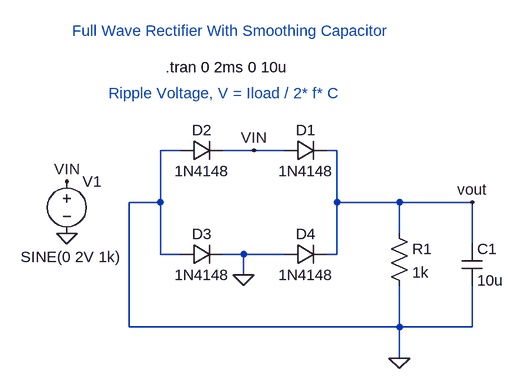
[diagram p0: schematic full_wave_rectifier.asc]
full_wave_rectifier.asc, the LTspice schematic file:
Version 4.1
SHEET 1 880 680
WIRE 64 112 32 112
WIRE 176 112 128 112
WIRE 224 112 176 112
WIRE 304 112 288 112
WIRE 32 192 32 112
WIRE 32 192 -16 192
WIRE 304 192 304 112
WIRE 400 192 304 192
WIRE 512 192 400 192
WIRE 400 240 400 192
WIRE 512 256 512 192
WIRE 32 272 32 192
WIRE 64 272 32 272
WIRE 160 272 128 272
WIRE 224 272 160 272
WIRE 304 272 304 192
WIRE 304 272 288 272
WIRE 160 304 160 272
WIRE -16 384 -16 192
WIRE 400 384 400 320
WIRE 400 384 -16 384
WIRE 512 384 512 320
WIRE 512 384 400 384
WIRE 400 432 400 384
FLAG 176 112 VIN
FLAG 160 304 0
FLAG -112 240 0
FLAG -112 160 VIN
FLAG 400 432 0
FLAG 512 192 vout
SYMBOL voltage -112 144 R0
WINDOW 3 -71 132 Left 2
WINDOW 123 0 0 Left 0
WINDOW 39 0 0 Left 0
SYMATTR InstName V1
SYMATTR Value SINE(0 2V 1k)
SYMBOL diode 224 128 R270
WINDOW 0 32 32 VTop 2
WINDOW 3 0 32 VBottom 2
SYMATTR InstName D1
SYMATTR Value 1N4148
SYMBOL diode 64 128 R270
WINDOW 0 32 32 VTop 2
WINDOW 3 0 32 VBottom 2
SYMATTR InstName D2
SYMATTR Value 1N4148
SYMBOL diode 64 288 R270
WINDOW 0 32 32 VTop 2
WINDOW 3 0 32 VBottom 2
SYMATTR InstName D3
SYMATTR Value 1N4148
SYMBOL diode 224 288 R270
WINDOW 0 32 32 VTop 2
WINDOW 3 0 32 VBottom 2
SYMATTR InstName D4
SYMATTR Value 1N4148
SYMBOL res 384 224 R0
SYMATTR InstName R1
SYMATTR Value 1k
SYMBOL cap 496 256 R0
SYMATTR InstName C1
SYMATTR Value 10u
TEXT -104 -72 Left 2 ;Full Wave Rectifier With Smoothing Capacitor
TEXT 40 -16 Left 2 !.tran 0 2ms 0 10u
TEXT -48 24 Left 2 ;Ripple Voltage, V = Iload / 2* f* C

The netlist it stands for:
* full_wave_rectifier.asc
V1 VIN 0 SINE(0 2V 1k)
D1 VIN vout 1N4148
D2 0 VIN 1N4148
D3 0 0 1N4148
D4 0 vout 1N4148
R1 vout 0 1k
C1 vout 0 10u
.model D D
.lib standard.dio
* Full Wave Rectifier With Smoothing Capacitor
.tran 0 2ms 0 10u
* Ripple Voltage, V = Iload / 2* f* C
.backanno
.end

* Results of the author's LTspice run, read from the files saved beside the schematic
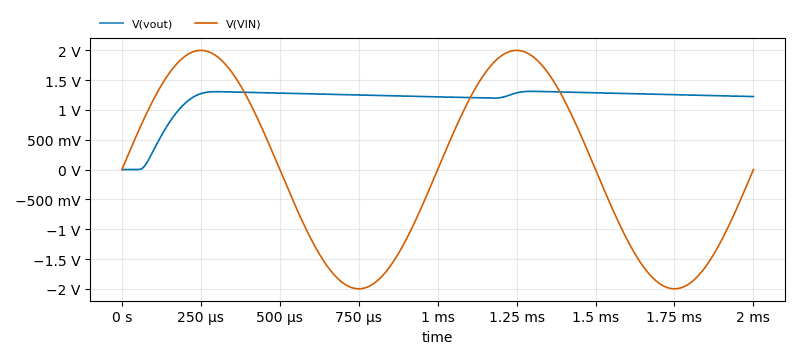
[diagram p1: Transient Analysis of full_wave_rectifier.asc, plotted from the saved traces]
* Transient Analysis, 1 run:
*   V(vout): min 0 V, max 1.313 V, average 1.174 V, rms 1.209 V, last 1.225 V
*   V(VIN): min -2 V, max 2 V, average 13.15 µV, rms 1.414 V, last 0 V